# Altium schematic sheet AGRIsense.SchDoc
size A4; Engineer: Kayann Soares; SheetNumber: 1; SheetTotal: 11; CompanyInfo1: Universidade Federal do Ceará; CompanyInfo2: Centro de Tecnologia - CT; CompanyInfo3: Dep. de Eng. de Teleinformática
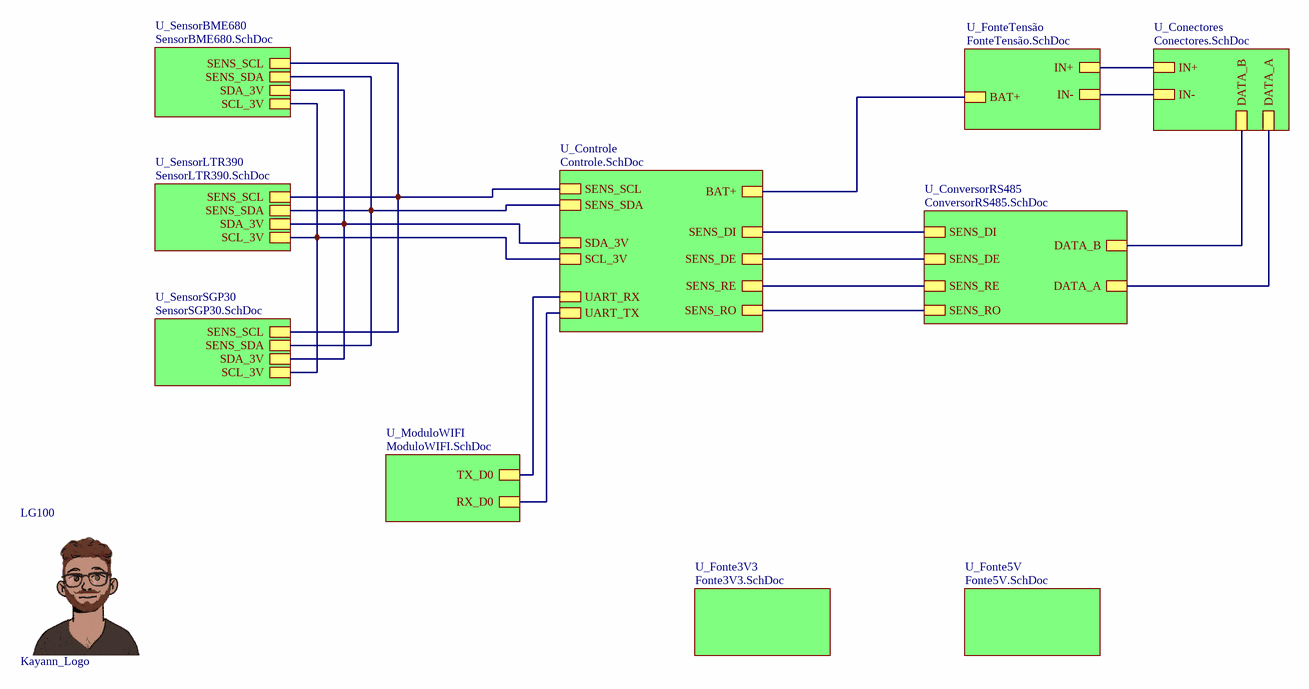
[diagram p0: AGRIsense.SchDoc]

## Parts
LG100  Kayann_Logo  [Kayann_Logo]

## Sub-sheets
U_Conectores = Conectores.SchDoc: IN+, IN-, DATA_A, DATA_B
U_Controle = Controle.SchDoc: SENS_SCL, SENS_SDA, SDA_3V, SCL_3V, UART_RX, UART_TX, SENS_DI, SENS_DE, SENS_RE, SENS_RO, BAT+
U_ConversorRS485 = ConversorRS485.SchDoc: SENS_DI, SENS_DE, SENS_RE, SENS_RO, DATA_A, DATA_B
U_Fonte3V3 = Fonte3V3.SchDoc: no entries
U_Fonte5V = Fonte5V.SchDoc: no entries
U_FonteTensão = FonteTensão.SchDoc: IN+, IN-, BAT+
U_ModuloWIFI = ModuloWIFI.SchDoc: RX_D0, TX_D0
U_SensorBME680 = SensorBME680.SchDoc: SENS_SCL, SENS_SDA, SDA_3V, SCL_3V
U_SensorLTR390 = SensorLTR390.SchDoc: SENS_SCL, SENS_SDA, SDA_3V, SCL_3V
U_SensorSGP30 = SensorSGP30.SchDoc: SENS_SCL, SENS_SDA, SDA_3V, SCL_3V

## Nets
(unnamed): sheet U_SensorSGP30/SENS_SCL, sheet U_SensorLTR390/SENS_SCL, sheet U_SensorBME680/SENS_SCL, sheet U_Controle/SENS_SCL
(unnamed): sheet U_SensorSGP30/SENS_SDA, sheet U_SensorLTR390/SENS_SDA, sheet U_SensorBME680/SENS_SDA, sheet U_Controle/SENS_SDA
(unnamed): sheet U_SensorSGP30/SDA_3V, sheet U_SensorLTR390/SDA_3V, sheet U_SensorBME680/SDA_3V, sheet U_Controle/SDA_3V
(unnamed): sheet U_SensorSGP30/SCL_3V, sheet U_SensorLTR390/SCL_3V, sheet U_SensorBME680/SCL_3V, sheet U_Controle/SCL_3V
(unnamed): sheet U_ModuloWIFI/RX_D0, sheet U_Controle/UART_TX
(unnamed): sheet U_ModuloWIFI/TX_D0, sheet U_Controle/UART_RX
(unnamed): sheet U_Conectores/IN+, sheet U_FonteTensão/IN+
(unnamed): sheet U_Conectores/IN-, sheet U_FonteTensão/IN-
(unnamed): sheet U_Conectores/DATA_A, sheet U_ConversorRS485/DATA_A
(unnamed): sheet U_Conectores/DATA_B, sheet U_ConversorRS485/DATA_B
(unnamed): sheet U_ConversorRS485/SENS_DI, sheet U_Controle/SENS_DI
(unnamed): sheet U_ConversorRS485/SENS_DE, sheet U_Controle/SENS_DE
(unnamed): sheet U_ConversorRS485/SENS_RE, sheet U_Controle/SENS_RE
(unnamed): sheet U_ConversorRS485/SENS_RO, sheet U_Controle/SENS_RO
(unnamed): sheet U_Controle/BAT+, sheet U_FonteTensão/BAT+

## Notes on the sheet
- Título:
- Padrão:
- Projeto:
- Eng. Responsável:
- A4
- Data:
- Versão:
- Folha:
- V1
- de
- Arquivo: